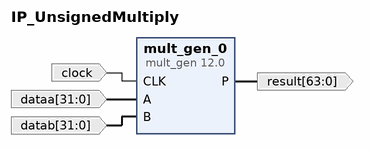
[diagram p0: block diagram of the top level]
# Vivado block design IP_UnsignedMultiply, xc7k325tffg676-1, Vivado 2021.2
create_bd_design IP_UnsignedMultiply

create_bd_port -dir I clock
create_bd_port -dir I -from 31 -to 0 dataa
create_bd_port -dir I -from 31 -to 0 datab
create_bd_port -dir O -from 63 -to 0 result

create_bd_cell -type ip -vlnv xilinx.com:ip:mult_gen:12.0 mult_gen_0
set_property -dict [list \
  CONFIG.Multiplier_Construction Use_Mults \
  CONFIG.PipeStages 3 \
  CONFIG.PortAType Unsigned \
  CONFIG.PortAWidth 32 \
  CONFIG.PortBType Unsigned \
  CONFIG.PortBWidth 32 \
] [get_bd_cells mult_gen_0]

# ---- connections ----

connect_bd_net [get_bd_ports clock] [get_bd_pins mult_gen_0/CLK]
connect_bd_net [get_bd_ports dataa] [get_bd_pins mult_gen_0/A]
connect_bd_net [get_bd_ports datab] [get_bd_pins mult_gen_0/B]
connect_bd_net [get_bd_pins mult_gen_0/P] [get_bd_ports result]

validate_bd_design
save_bd_design
